# Altium project ADC-and-DAC-Design.PrjPcb
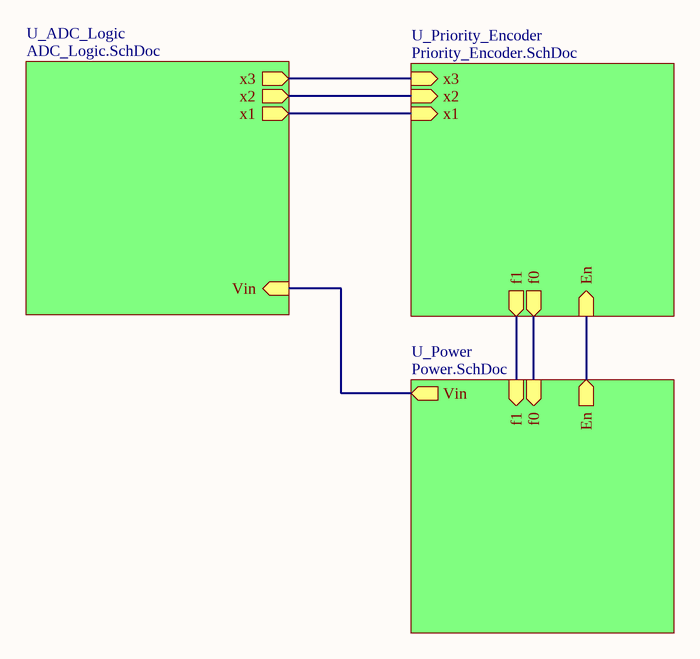
[diagram p0: TopView.SchDoc]
4 sheets, 32 parts. Net scope: hierarchical (ports join the sheet entries above them; power ports are global).
Board file: PCB1.PcbDoc
Sheets:
  TopView.SchDoc
    U_ADC_Logic = ADC_Logic.SchDoc
    U_Power = Power.SchDoc
    U_Priority_Encoder = Priority_Encoder.SchDoc

## Sheet TopView.SchDoc
size 431 x 279 mm; Organization: ORGANIZATION; Address1: ADDRESS 1; Address2: ADDRESS 2; Address3: ADDRESS 3; Address4: ADDRESS 4; Revision: -; SheetNumber: 1; SheetTotal: 4; ENG_APP_DATE: --/--/--; DSN_APP_DATE: --/--/--; CHK_APP_DATE: --/--/--

### Sub-sheets
U_ADC_Logic = ADC_Logic.SchDoc: x3 (out), x2 (out), x1 (out), Vin (in)
U_Power = Power.SchDoc: En (out), f0 (in), f1 (in), Vin (out)
U_Priority_Encoder = Priority_Encoder.SchDoc: x1 (in), x2 (in), x3 (in), En (in), f0 (out), f1 (out)

### Nets
f0: sheet U_Power/f0, sheet U_Priority_Encoder/f0
f1: sheet U_Power/f1, sheet U_Priority_Encoder/f1
x1: sheet U_ADC_Logic/x1, sheet U_Priority_Encoder/x1
x2: sheet U_ADC_Logic/x2, sheet U_Priority_Encoder/x2
x3: sheet U_ADC_Logic/x3, sheet U_Priority_Encoder/x3
NetJ1_3: sheet U_Power/En, sheet U_Priority_Encoder/En
NetJ1_6: sheet U_ADC_Logic/Vin, sheet U_Power/Vin

### Notes on the sheet
- DWG. NO.
- REV.
- SHT.
- THIS DOCUMENT AND THE DATA DISCLOSED HEREIN OR HEREWITH IS THE PROPERTY OF ALTIUM LIMITED AND MAY BE FREELY DISTRIBUTED IN WHOLE. NO RIGHTS ARE RESERVED OR EXPRESS OR IMPLIED WARANTEE GIVEN.
- REVISION
- DESCRIPTION
- DATE
- APPROVED
- ENG:
- APPROVALS
- PROJECT
- DSN:
- CHK:
- REFERENCE DOCUMENTS
- PROJECT REVISION:
- TITLE
- DOCUMENT REVISION:
- DESIGN ITEM:
- BOM:
- FAB DWG:
- PCB DWG:
- ASSY DWG:
- SCALE:
- SIZE
- B
- CAGE CODE
- FILE NAME
- DWG NO.
- SHEET
- OF
- REV

## Sheet ADC_Logic.SchDoc
size 431 x 279 mm; Organization: ORGANIZATION; Address1: ADDRESS 1; Address2: ADDRESS 2; Address3: ADDRESS 3; Address4: ADDRESS 4; Revision: -; SheetNumber: 4; SheetTotal: 4; ENG_APP_DATE: --/--/--; DSN_APP_DATE: --/--/--; CHK_APP_DATE: --/--/--
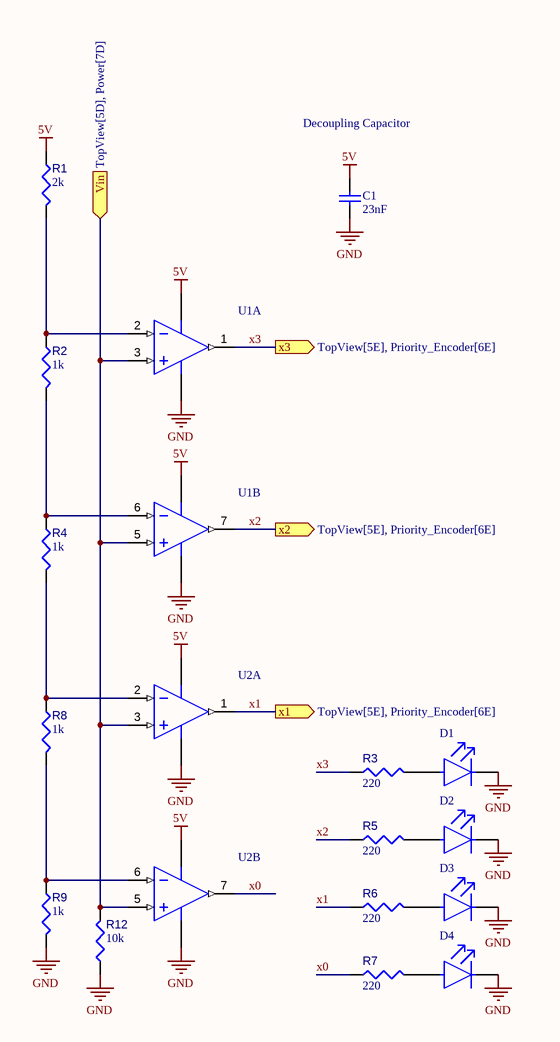
[diagram p1: ADC_Logic.SchDoc]

### Parts
C1  23nF  [KEMT-C315-THT-2]
D1  LTL2P3KGKNN  [FP-LTL2P3KGKNN-MFG]  (value not drawn)
D2  LTL2P3KGKNN  [FP-LTL2P3KGKNN-MFG]  (value not drawn)
D3  LTL2P3KGKNN  [FP-LTL2P3KGKNN-MFG]  (value not drawn)
D4  LTL2P3KGKNN  [FP-LTL2P3KGKNN-MFG]  (value not drawn)
R1  value 2k  [RESA60-630X240]  (hidden comment: MFR-25FBF52-100R)
R2  value 1k  [RESA60-630X240]  (hidden comment: MFR-25FBF52-100R)
R3  value 220  [RESA60-630X240]  (hidden comment: MFR-25FBF52-100R)
R4  value 1k  [RESA60-630X240]  (hidden comment: MFR-25FBF52-100R)
R5  value 220  [RESA60-630X240]  (hidden comment: MFR-25FBF52-100R)
R6  value 220  [RESA60-630X240]  (hidden comment: MFR-25FBF52-100R)
R7  value 220  [RESA60-630X240]  (hidden comment: MFR-25FBF52-100R)
R8  value 1k  [RESA60-630X240]  (hidden comment: MFR-25FBF52-100R)
R9  value 1k  [RESA60-630X240]  (hidden comment: MFR-25FBF52-100R)
R12  10k  [RESA60-630X240]
U1  LM358N/NOPB  [P0008A]  (value not drawn)  (parts A,B of 2)
U2  LM358N/NOPB  [P0008A]  (value not drawn)  (parts A,B of 2)

### Ports
Vin (in, see TopView[5D], Power[7D]), x1 (out, see TopView[5E], Priority_Encoder[6E]), x2 (out, see TopView[5E], Priority_Encoder[6E]), x3 (out, see TopView[5E], Priority_Encoder[6E])

### Nets
5V: C1.2 R1.1 U1.8(V+) U2.8(V+)
GND: C1.1 D1.1(C) D2.1(C) D3.1(C) D4.1(C) R9.2 R12.1 U1.4(GND) U2.4(GND)
x0: R7.1 U2.7(OUTB)
x1: R6.1 U2.1(OUTA) ; port x1
x2: R5.1 U1.7(OUTB) ; port x2
x3: R3.1 U1.1(OUTA) ; port x3
NetD1_2: D1.2(A) R3.2
NetD2_2: D2.2(A) R5.2
NetD3_2: D3.2(A) R6.2
NetD4_2: D4.2(A) R7.2
NetJ1_6: R12.2 U1.3(INA+) U1.5(INB+) U2.3(INA+) U2.5(INB+) ; port Vin
NetR1_2: R1.2 R2.1 U1.2(INA-)
NetR2_2: R2.2 R4.1 U1.6(INB-)
NetR4_2: R4.2 R8.1 U2.2(INA-)
NetR8_2: R8.2 R9.1 U2.6(INB-)

### Notes on the sheet
- Decoupling Capacitor
- DWG. NO.
- REV.
- SHT.
- THIS DOCUMENT AND THE DATA DISCLOSED HEREIN OR HEREWITH IS THE PROPERTY OF ALTIUM LIMITED AND MAY BE FREELY DISTRIBUTED IN WHOLE. NO RIGHTS ARE RESERVED OR EXPRESS OR IMPLIED WARANTEE GIVEN.
- REVISION
- DESCRIPTION
- DATE
- APPROVED
- ENG:
- APPROVALS
- PROJECT
- DSN:
- CHK:
- REFERENCE DOCUMENTS
- PROJECT REVISION:
- TITLE
- DOCUMENT REVISION:
- DESIGN ITEM:
- BOM:
- FAB DWG:
- PCB DWG:
- ASSY DWG:
- SCALE:
- SIZE
- B
- CAGE CODE
- FILE NAME
- DWG NO.
- SHEET
- OF
- REV

### Library data of the parts
C1 = CMP-1664-00007-1: Capacitor, Ceramic, 0.01 uF, +/- 10%, 100 V, X7R, -55 to 125 degC, 2-Pin THD, RoHS, Bulk; Output Voltage: 70 V; Case\Package: PDIP; Forward Current: 60 mA; Nominal Vf: 1.3 V; Forward Voltage: 1.5 V; Channels: 2; Max Power Dissipation: 400 mW; Vce Max: 500 mV; ComponentLink1Description: Manufacturer URL; ComponentLink2Description: Datasheet; Packaging: Rail/Tube; RoHSCompliant: true; Package Quantity: 2000; PackageReference: C315-THT-2; Min Operating Temperature: -55 degC; Max Operating Temperature: 100 degC; Radiation Hardening: No; ComponentLink1URL: http://www.kemet.com/; DatasheetVersion: Aug-16; Pins: 16; PackageDescription: 2-Pin Through Hole Device, Body 3.81 x 2.54 mm; REACH SVHC: Unknown; Mount: Through Hole; ComponentLink2URL: http://capacitoredge.kemet.com/capedge2/DataSheet/Datasheet-C315C103K1R5TA.pdf?pn=C315C103K1R5TA{BULK}
D1-D4 = CMP-22017-000002-1: LED GREEN CLEAR T-1 3/4 T/H; Manufacturer: Lite-On; Forward Voltage: 2.1V; Led Orientation: Straight; Forward Current: 20mA; Luminous Intensity: 980mcd; Wavelength: 572nm; Power Dissipation: 75mW; Peak Emmision Wavelength: 575nm; Viewing Angle: 22°; Reverse Voltage: 5V; Category: Diode; Temperature Range Low: -40°C; Device Class L1: Optoelectronics; Temperature: -40°C to +100°C; Mouser Description: LED Uni-Color Green 575nm 2-Pin T-1 3/4; Height: 9.95mm; Package: 0; Colour: Green; ComponentLink2Description: Datasheet; Digikey Description: LED GREEN CLEAR T-1 3/4 T/H; Automotive: No; Lead Free: Yes; ComponentLink2URL: https://optoelectronics.liteon.com/upload/download/DS20-2000-193/LTL2P3KGKNN.pdf; Manufacturer Part Number: LTL2P3KGKNN; Temperature Range High: +100°C; RoHS: TRUE; Device Class L2: LEDs; Device Class L3: unset; Octopart: https://octopart.com/ltl2p3kgknn-lite-on-550036
R1-R9 R12 = CMP-009-00046-4: Axial Resistor, 100 Ohm, +/- 1%, 0.25 W, -55 to 155 degC, 2-Pin THD, RoHS, Bulk; Manufacturer: Yageo; Voltage Rating: 250V; Power: 250mW; Packaging: Bulk; Max Operating Temperature: 155°C; Mounting Technology: TH; Datasheet Version: Apr-13; Case/Package: Axial; RoHS Compliant: True; Package Description: 2-Pin Axial Lead, Dia 2.4 mm, Body Length 6.3 mm; Package Quantity: 200; Package Reference: MFR-25; Tolerance: 1%; Composition: CarbonFilm; Datasheet URL: http://www.yageo.com/documents/recent/Yageo%20LR_MFR_2013.pdf; Manufacturer URL: http://www.yageo.com/; Min Operating Temperature: -55°C
  R12: Value: 10k
U1 U2 = CMP-0055-00153-3: Low Power Dual Operational Amplifier, 8-pin MDIP, Pb-Free; Manufacturer: Texas Instruments; PowerWise: N; PackageTopMarking: NSUZXYTTE#*LM*358N; CompType: Amplifiers; Package Reference: P0008A; PinCount: 8; ComponentLink1URL: http://www.ti.com/general/docs/lit/getliterature.tsp?genericPartNumber=LM358-N&fileType=pdf; Code_JEDEC: MS-001-BA; PackageDescription: MDIP, .365 x .250 x .130in, 8 Lead, .100in Pitch; RoHS: Y; ComponentLink1Description: Datasheet URL

## Sheet Power.SchDoc
size 431 x 279 mm; Organization: ORGANIZATION; Address1: ADDRESS 1; Address2: ADDRESS 2; Address3: ADDRESS 3; Address4: ADDRESS 4; Revision: -; SheetNumber: 3; SheetTotal: 4; ENG_APP_DATE: --/--/--; DSN_APP_DATE: --/--/--; CHK_APP_DATE: --/--/--
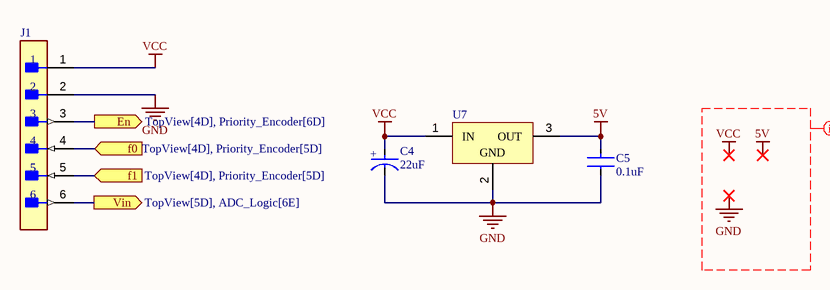
[diagram p2: Power.SchDoc]

### Parts
C4  22uF  [FP-RAD-TH-D_5_0_5-L_11_1-MFG]
C5  0.1uF  [FP-K15H5-MFG]
J1  22-28-4060  [FP-22-28-4060-MFG]  (value not drawn)
U7  MC7805CTG  [ONSC-TO-220-3-221AB-01]  (value not drawn)

### Ports
En (out, see TopView[4D], Priority_Encoder[6D]), f0 (in, see TopView[4D], Priority_Encoder[5D]), f1 (in, see TopView[4D], Priority_Encoder[5D]), Vin (out, see TopView[5D], ADC_Logic[6E])

### Nets
5V: C5.1 U7.3(OUT)
GND: C4.1(C) C5.2 J1.2 U7.2(GND)
VCC: C4.2(A) J1.1 U7.1(IN)
f0: J1.4 ; port f0
f1: J1.5 ; port f1
NetJ1_3: J1.3 ; port En
NetJ1_6: J1.6 ; port Vin

### Layout directives
net class Power; rule Width Constraint [Pref Width = 10mil    Min Width = 10mil    Max Width = 10mil]: 5V, GND, VCC

### Notes on the sheet
- Labels drawn without touching a wire or pin: 5V, GND, VCC
- DWG. NO.
- REV.
- SHT.
- THIS DOCUMENT AND THE DATA DISCLOSED HEREIN OR HEREWITH IS THE PROPERTY OF ALTIUM LIMITED AND MAY BE FREELY DISTRIBUTED IN WHOLE. NO RIGHTS ARE RESERVED OR EXPRESS OR IMPLIED WARANTEE GIVEN.
- REVISION
- DESCRIPTION
- DATE
- APPROVED
- ENG:
- APPROVALS
- PROJECT
- DSN:
- CHK:
- REFERENCE DOCUMENTS
- PROJECT REVISION:
- TITLE
- DOCUMENT REVISION:
- DESIGN ITEM:
- BOM:
- FAB DWG:
- PCB DWG:
- ASSY DWG:
- SCALE:
- SIZE
- B
- CAGE CODE
- FILE NAME
- DWG NO.
- SHEET
- OF
- REV
- (in symbol CMP-05427-001989-1) +

### Library data of the parts
C4 = CMP-05427-001989-1: Aluminum Electrolytic Capacitors (Radial Lead Type) AEC-Q200 Qualified 22uF ±20% 50V; Ripple Current: 155mA; Polarity: Polar; ESR (Equivalent Series Resistance): 1.3R; Life (Hours): 1000Hour; Leakage Current: 3uA; Lead Diameter: 0.5mm; Termination: Radial; Radiation Hardening: No; RoHS Compliant: Yes; Case/Package: Radial; Height: 11mm; Package Quantity: 2000; Min Operating Temperature: -55°C; Length: 11mm; Contact Plating: Tin; Series: FC; Voltage Rating: 50V; Diameter: 5mm; Capacitance: 22uF; Features: General Purpose; Max Operating Temperature: 105°C; Tolerance: 20%; Voltage Rating (DC): 50V; Mount: Through Hole; Impedance: 1.3R; Lead Pitch: 0.197inch; Packaging: Tape and Reel; Height - Seated (Max): 0.472inch
C5 = CMP-02417-000078-1: CAP CER 0.1UF 50V X7R RADIAL; Capacitance: 100nF; Tolerance: 10%; Dielectric Material: Ceramic; Lead Length: 30mm; Lead Diameter: 0.5mm; Lead/Base Style: Formed Leads; Diameter: 500um; Max Operating Temperature: 125°C; Case/Package: Dipped; Dielectric: X7R; Lead Free: Lead Free; Construction: RADIAL; Voltage: 50V; Thickness: 2.6mm; Min Operating Temperature: -55°C; Lead Pitch: 5mm; Height: 4mm; Radiation Hardening: No; Voltage Rating: 50V; Depth: 2.5mm; Voltage Rating (DC): 50V; Package Quantity: 1; Weight: 0.005644oz; Series: K; Mount: Through Hole; Termination: Radial; Height - Seated (Max): 0.257inch; Length: 4mm; Packaging: Tape and Reel; Width: 2.5mm; RoHS Compliant: Yes
J1 = CMP-04776-000763-1: CONN HEADER VERT 6POS 2.54MM; Voltage Rating: 250V; Current Rating: 4A; Number of Contacts: 6; Max Voltage Rating (DC): 250.25kV; Gender: Male; Contact Resistance: 20mR; Connector Type: Male Pin; Color: Black; Max Voltage Rating (AC): 250V; Pitch: 2.54mm; Orientation: Straight; Max Operating Temperature: 75°C; Contact Plating: Tin; Depth: 2.49mm; Contact Type: Male Pin; Number of Positions: 6; Length: 15.24mm; Packaging: Bulk; Mount: Through Hole; Housing Material: Thermoplastic; Housing Color: Black; Termination: Solder; Contact Material: Brass; Min Operating Temperature: 0°C; Series: KK® 42375; Number of Rows: 1; Package Quantity: 1; RoHS Compliant: Yes; Contact Mating Length: 0.24inch
U7 = CMP-2000-04928-1: Positive Voltage Regulator, 1 A, 5 V, 0 to 125 degC, 3-Pin TO-220, RoHS, Tube; Manufacturer: ON Semiconductor; Resistance, Thermal, Junction to Case: 5degC/W; Voltage, Supply: 35V; Regulator Function: Standard; Temperature, Operating, Maximum: +125degC; Load Regulation: 25mV; Regulator Type: PositiveVoltageOut; Current, Output, Maximum: 1A; Regulation, Load: 1.3mV; Number of Outputs: 1; Temperature, Operating, Range: 0to+125degC; Regulation, Line: 0.5mV; Line Regulation: 20mV; Voltage, Input Range: Maximumof35V; Output Type: Fixed; Current, Quiescent Supply: 6.5mA; Dropout Voltage: 2V; Temperature, Operating, Minimum: 0degC; Package Version: Rev. A, 11/2010; Current, Supply: 3.2mA; Voltage, Output: 5V; Voltage, Noise: 10μV/V; Package Type: TO-220; Voltage, Input, High Level: 35V; Datasheet URL: http://www.onsemi.com/pub_link/Collateral/MC7800-D.PDF; Dimensions: 10.28x4.82x15.75mm; Width: 4.82mm; Type: VoltageRegulator; Mounting Type: ThroughHole; Polarity: Positive; Datasheet Version: Rev. 27, 11/2014; Height: 15.75mm; Dropout Voltage Measurement Current: 1A; Package Description: 3-Pin Flange Mount, Vertical Straight Lead, Body 9.97 x 4.445 mm, Pitch 2.54 mm; Manufacturer URL: http://www.onsemi.com/; Voltage, Dropout: 2V; Length: 10.28mm; Number of Pins: 3; Package Reference: TO-220-3-221AB-01

## Sheet Priority_Encoder.SchDoc
size 431 x 279 mm; Organization: ORGANIZATION; Address1: ADDRESS 1; Address2: ADDRESS 2; Address3: ADDRESS 3; Address4: ADDRESS 4; Revision: -; SheetNumber: 2; SheetTotal: 4; ENG_APP_DATE: --/--/--; DSN_APP_DATE: --/--/--; CHK_APP_DATE: --/--/--
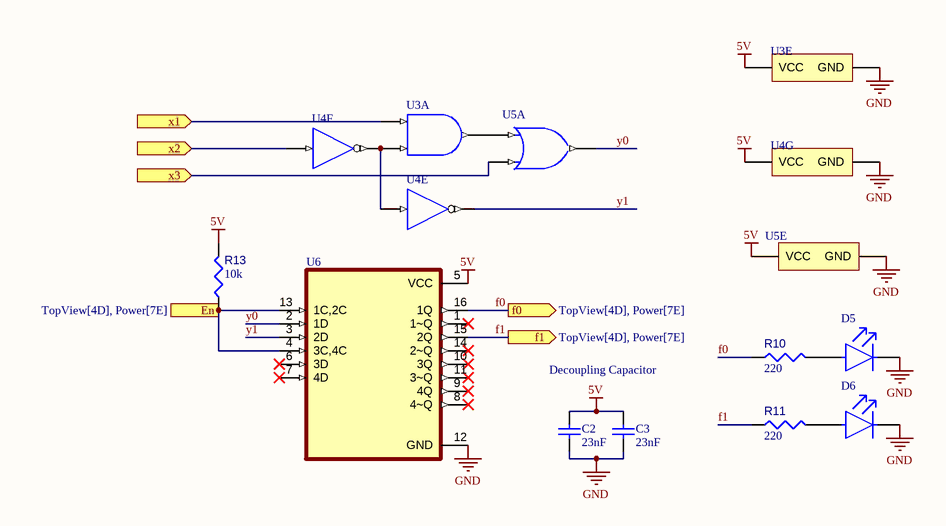
[diagram p3: Priority_Encoder.SchDoc]

### Parts
C2  23nF  [KEMT-C315-THT-2]
C3  23nF  [KEMT-C315-THT-2]
D5  LTL2P3KGKNN  [FP-LTL2P3KGKNN-MFG]  (value not drawn)
D6  LTL2P3KGKNN  [FP-LTL2P3KGKNN-MFG]  (value not drawn)
R10  value 220  [RESA60-630X240]  (hidden comment: MFR-25FBF52-100R)
R11  value 220  [RESA60-630X240]  (hidden comment: MFR-25FBF52-100R)
R13  10k  [RESA60-630X240]
U3  SN74LS08N  [N0014A]  (value not drawn)  (parts A,E of 5)
U4  SN74LS04N  [N0014A]  (value not drawn)  (parts E,F,G of 7)
U5  SN74LS32N  [N0014A]  (value not drawn)  (parts A,E of 5)
U6  SN74LS75N  [DIP794W45P254L1969H508Q16]  (value not drawn)

### Ports
En (in, see TopView[4D], Power[7E]), f0 (out, see TopView[4D], Power[7E]), f1 (out, see TopView[4D], Power[7E]), x1 (in, see TopView[5E], ADC_Logic[5C]), x2 (in, see TopView[5E], ADC_Logic[5D]), x3 (in, see TopView[5E], ADC_Logic[5D])

### Nets
5V: C2.2 C3.2 R13.2 U3.14(VCC) U4.14(VCC) U5.14(VCC) U6.5(VCC)
GND: C2.1 C3.1 D5.1(C) D6.1(C) U3.7(GND) U4.7(GND) U5.7(GND) U6.12(GND)
f0: R10.1 U6.16(1Q) ; port f0
f1: R11.1 U6.15(2Q) ; port f1
x1: U3.1(1A) ; port x1
x2: U4.13(6A) ; port x2
x3: U5.2(1B) ; port x3
y0: U5.3(1Y) U6.2(1D)
y1: U4.10(~{5Y}) U6.3(2D)
NetD5_2: D5.2(A) R10.2
NetD6_2: D6.2(A) R11.2
NetJ1_3: R13.1 U6.4(3C,4C) U6.13(1C,2C) ; port En
NetU3_2: U3.2(1B) U4.11(5A) U4.12(~{6Y})
NetU3_3: U3.3(1Y) U5.1(1A)

Not connected (* = marked no-connect by the designer): U6 1(1~Q)* 6(3D)* 7(4D)* 8(4~Q)* 9(4Q)* 10(3Q)* 11(3~Q)* 14(2~Q)*

### Notes on the sheet
- Decoupling Capacitor
- DWG. NO.
- REV.
- SHT.
- THIS DOCUMENT AND THE DATA DISCLOSED HEREIN OR HEREWITH IS THE PROPERTY OF ALTIUM LIMITED AND MAY BE FREELY DISTRIBUTED IN WHOLE. NO RIGHTS ARE RESERVED OR EXPRESS OR IMPLIED WARANTEE GIVEN.
- REVISION
- DESCRIPTION
- DATE
- APPROVED
- ENG:
- APPROVALS
- PROJECT
- DSN:
- CHK:
- REFERENCE DOCUMENTS
- PROJECT REVISION:
- TITLE
- DOCUMENT REVISION:
- DESIGN ITEM:
- BOM:
- FAB DWG:
- PCB DWG:
- ASSY DWG:
- SCALE:
- SIZE
- B
- CAGE CODE
- FILE NAME
- DWG NO.
- SHEET
- OF
- REV

### Library data of the parts
C2 C3 = CMP-1664-00007-1: as C1 on sheet ADC_Logic; ComponentLink1Description: Manufacturer URL; ComponentLink2Description: Datasheet; Packaging: Rail/Tube; RoHSCompliant: true; Package Quantity: 2000; PackageReference: C315-THT-2; Min Operating Temperature: -55 degC; Max Operating Temperature: 100 degC; Radiation Hardening: No; ComponentLink1URL: http://www.kemet.com/; DatasheetVersion: Aug-16; Pins: 16; PackageDescription: 2-Pin Through Hole Device, Body 3.81 x 2.54 mm; REACH SVHC: Unknown; Mount: Through Hole; ComponentLink2URL: http://capacitoredge.kemet.com/capedge2/DataSheet/Datasheet-C315C103K1R5TA.pdf?pn=C315C103K1R5TA{BULK}
D5 D6 = CMP-22017-000002-1: as D1 on sheet ADC_Logic; Category: Diode; Temperature Range Low: -40°C; Device Class L1: Optoelectronics; Temperature: -40°C to +100°C; Mouser Description: LED Uni-Color Green 575nm 2-Pin T-1 3/4; Height: 9.95mm; Package: 0; Colour: Green; ComponentLink2Description: Datasheet; Digikey Description: LED GREEN CLEAR T-1 3/4 T/H; Automotive: No; Lead Free: Yes; ComponentLink2URL: https://optoelectronics.liteon.com/upload/download/DS20-2000-193/LTL2P3KGKNN.pdf; Manufacturer Part Number: LTL2P3KGKNN; Temperature Range High: +100°C; RoHS: TRUE; Device Class L2: LEDs; Device Class L3: unset; Octopart: https://octopart.com/ltl2p3kgknn-lite-on-550036
R10 R11 R13 = CMP-009-00046-4: as R1 on sheet ADC_Logic; Packaging: Bulk; Max Operating Temperature: 155°C; Mounting Technology: TH; Datasheet Version: Apr-13; Case/Package: Axial; RoHS Compliant: True; Package Description: 2-Pin Axial Lead, Dia 2.4 mm, Body Length 6.3 mm; Package Quantity: 200; Package Reference: MFR-25; Tolerance: 1%; Composition: CarbonFilm; Datasheet URL: http://www.yageo.com/documents/recent/Yageo%20LR_MFR_2013.pdf; Manufacturer URL: http://www.yageo.com/; Min Operating Temperature: -55°C
  R13: Value: 10k
U3 = CMP-0777-00259-3: Quadruple 2-Input Positive-AND Gates, N0014A, TUBE; Manufacturer: Texas Instruments; VCC(Max)(V): 5.25; ICC @ Nom Voltage(Max)(mA): 0.021; VCC(Min)(V): 4.75; tpd @ Nom Voltage(Max)(ns): 25; Rating: Catalog; Output Type: TTL; Bits(#): 4; Schmitt Trigger: No; Voltage(Nom)(V): 5; Technology Family: LS; F @ Nom Voltage(Max)(Mhz): 35; Output Drive (IOL/IOH)(Max)(mA): -0.8/16; PackageReference: N0014A; DatasheetVersion: SDLS033; Input Type: TTL; Operating Temperature Range(C): 0 to 70; Generic Part Number: SN74LS08
U4 = CMP-1615-00911-2: Hex inverters, N0014A, TUBE; Manufacturer: Texas Instruments; Output Drive (IOL/IOH)(Max)(mA): -0.4/8; Schmitt Trigger: No; F @ Nom Voltage(Max)(Mhz): 35; Voltage(Nom)(V): 5; Technology Family: LS; Input Type: TTL; Output Type: CMOS; Bits(#): 6; VCC(Max)(V): 5.25; ICC @ Nom Voltage(Max)(mA): 0.033; Rating: Catalog; VCC(Min)(V): 4.75; tpd @ Nom Voltage(Max)(ns): 22; Operating Temperature Range(C): 0 to 70; DatasheetVersion: SDLS029C; Generic Part Number: SN74LS04; Code_JEDEC: MS-001; PackageReference: N0014A
U5 = CMP-1573-00145-3: Quad 2-input positive-OR gates, N0014A, TUBE; Manufacturer: Texas Instruments; tpd @ Nom Voltage(Max)(ns): 22; Output Drive (IOL/IOH)(Max)(mA): 0.8/-16; Input Type: TTL; VCC(Min)(V): 4.75; F @ Nom Voltage(Max)(Mhz): 35; Voltage(Nom)(V): 5; ICC @ Nom Voltage(Max)(mA): 0.038; VCC(Max)(V): 5.25; Rating: Catalog; Bits(#): 4; Generic Part Number: SN74LS32; DatasheetVersion: SDLS100; Operating Temperature Range(C): 0 to 70; Output Type: TTL; Code_JEDEC: MS-001; PackageVersion: http://www.ti.com/lit/ml/mpdi002c/mpdi002c.pdf; PackageReference: N0014A
U6 = SN74LS75N: Quad bistable latches; MF: Texas Instruments; Price: None; Availability: In Stock; MP: SN74LS75N; Package: PDIP-16 Texas Instruments; SnapEDA_Link: https://www.snapeda.com/parts/SN74LS75N/Texas+Instruments/view-part/?ref=snap; Check_prices: https://www.snapeda.com/parts/SN74LS75N/Texas+Instruments/view-part/?ref=eda; Value: *; Purchase-URL: https://pricing.snapeda.com/search/part/SN74LS75N/?ref=eda

## Nets that join several sheets
5V: ADC_Logic (C1.2 R1.1 U1.8 U2.8), Power (C5.1 U7.3), Priority_Encoder (7 pins)
GND: ADC_Logic (9 pins), Power (C4.1 C5.2 J1.2 U7.2), Priority_Encoder (8 pins)
f0: Power (J1.4), Priority_Encoder (R10.1 U6.16)
f1: Power (J1.5), Priority_Encoder (R11.1 U6.15)
NetJ1_3: Power (J1.3), Priority_Encoder (R13.1 U6.4 U6.13)
NetJ1_6: ADC_Logic (5 pins), Power (J1.6)
x1: ADC_Logic (R6.1 U2.1), Priority_Encoder (U3.1)
x2: ADC_Logic (R5.1 U1.7), Priority_Encoder (U4.13)
x3: ADC_Logic (R3.1 U1.1), Priority_Encoder (U5.2)